# EasyEDA schematic EasyEDA PLsi_v0 schematic source.json

## Sheets
1 CPU & HMI: TITLE: CPU & HMI; REV: 1.0; Date: 2019-08-10; Sheet: 1/3; Drawn By: funnyautomation; Company: funnyautomation
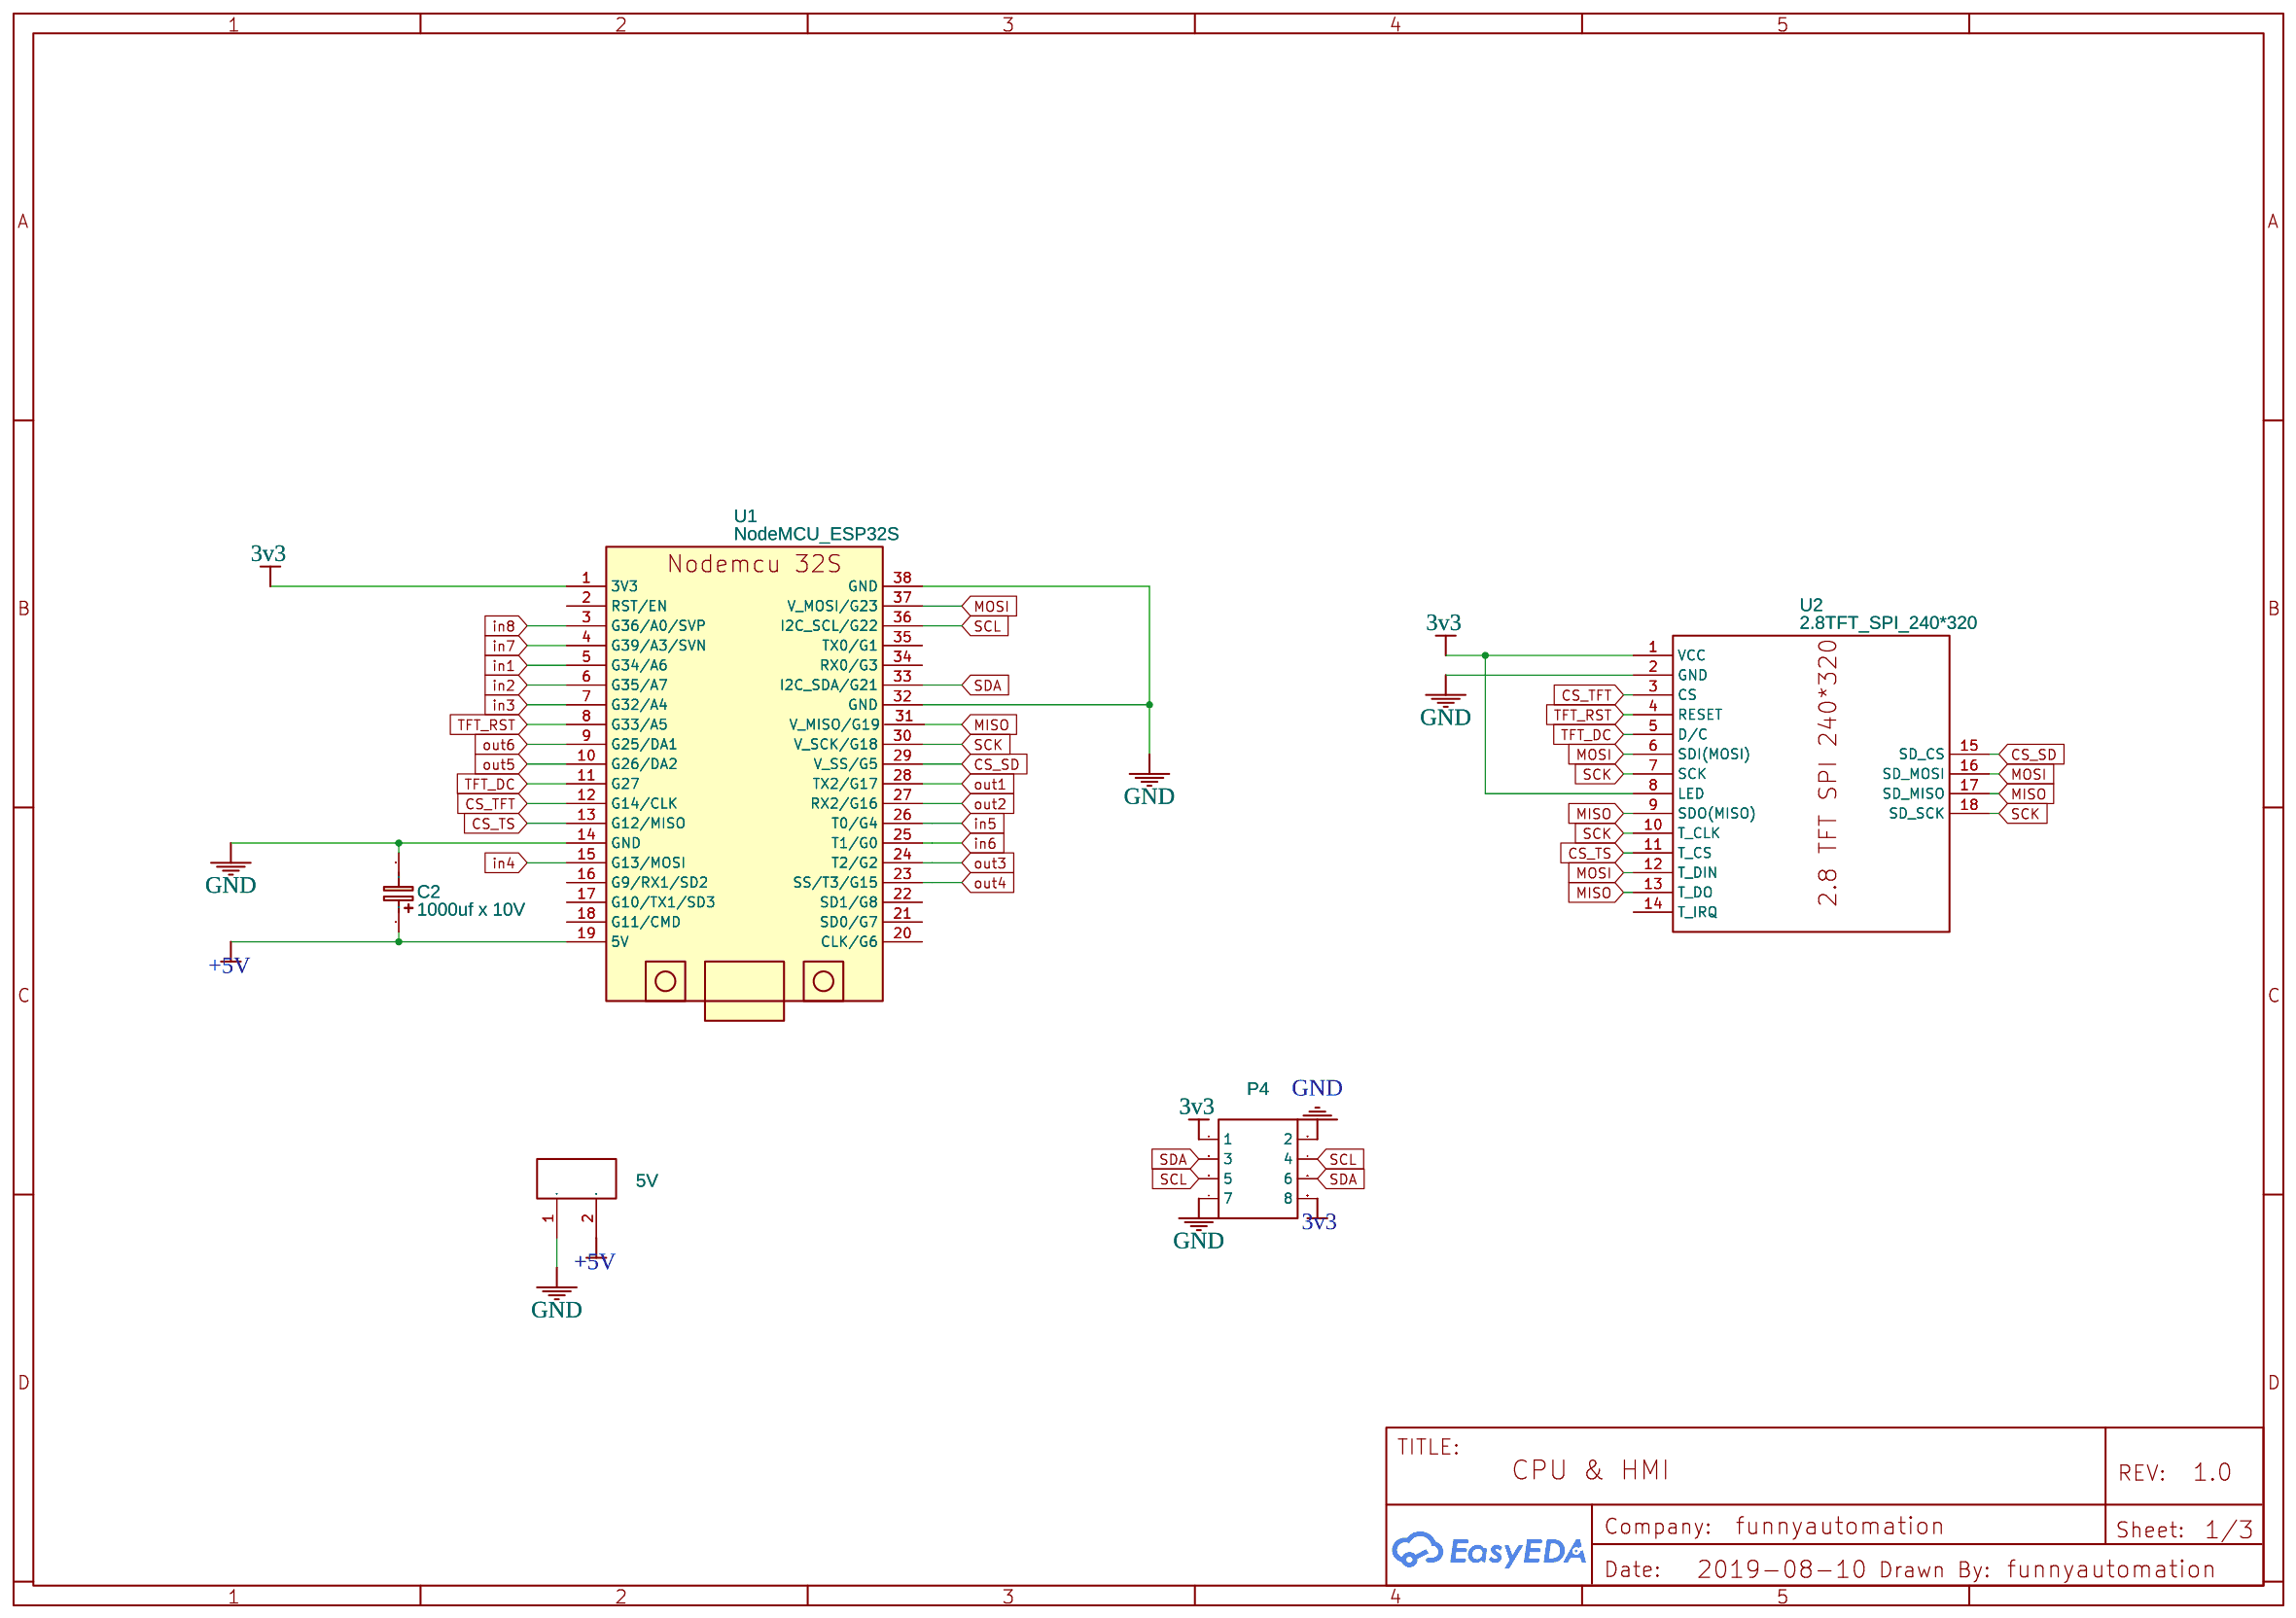
[diagram p0: CPU & HMI]
2 Inputs: TITLE: Inputs; Date: 2019-08-17; Sheet: 2/3
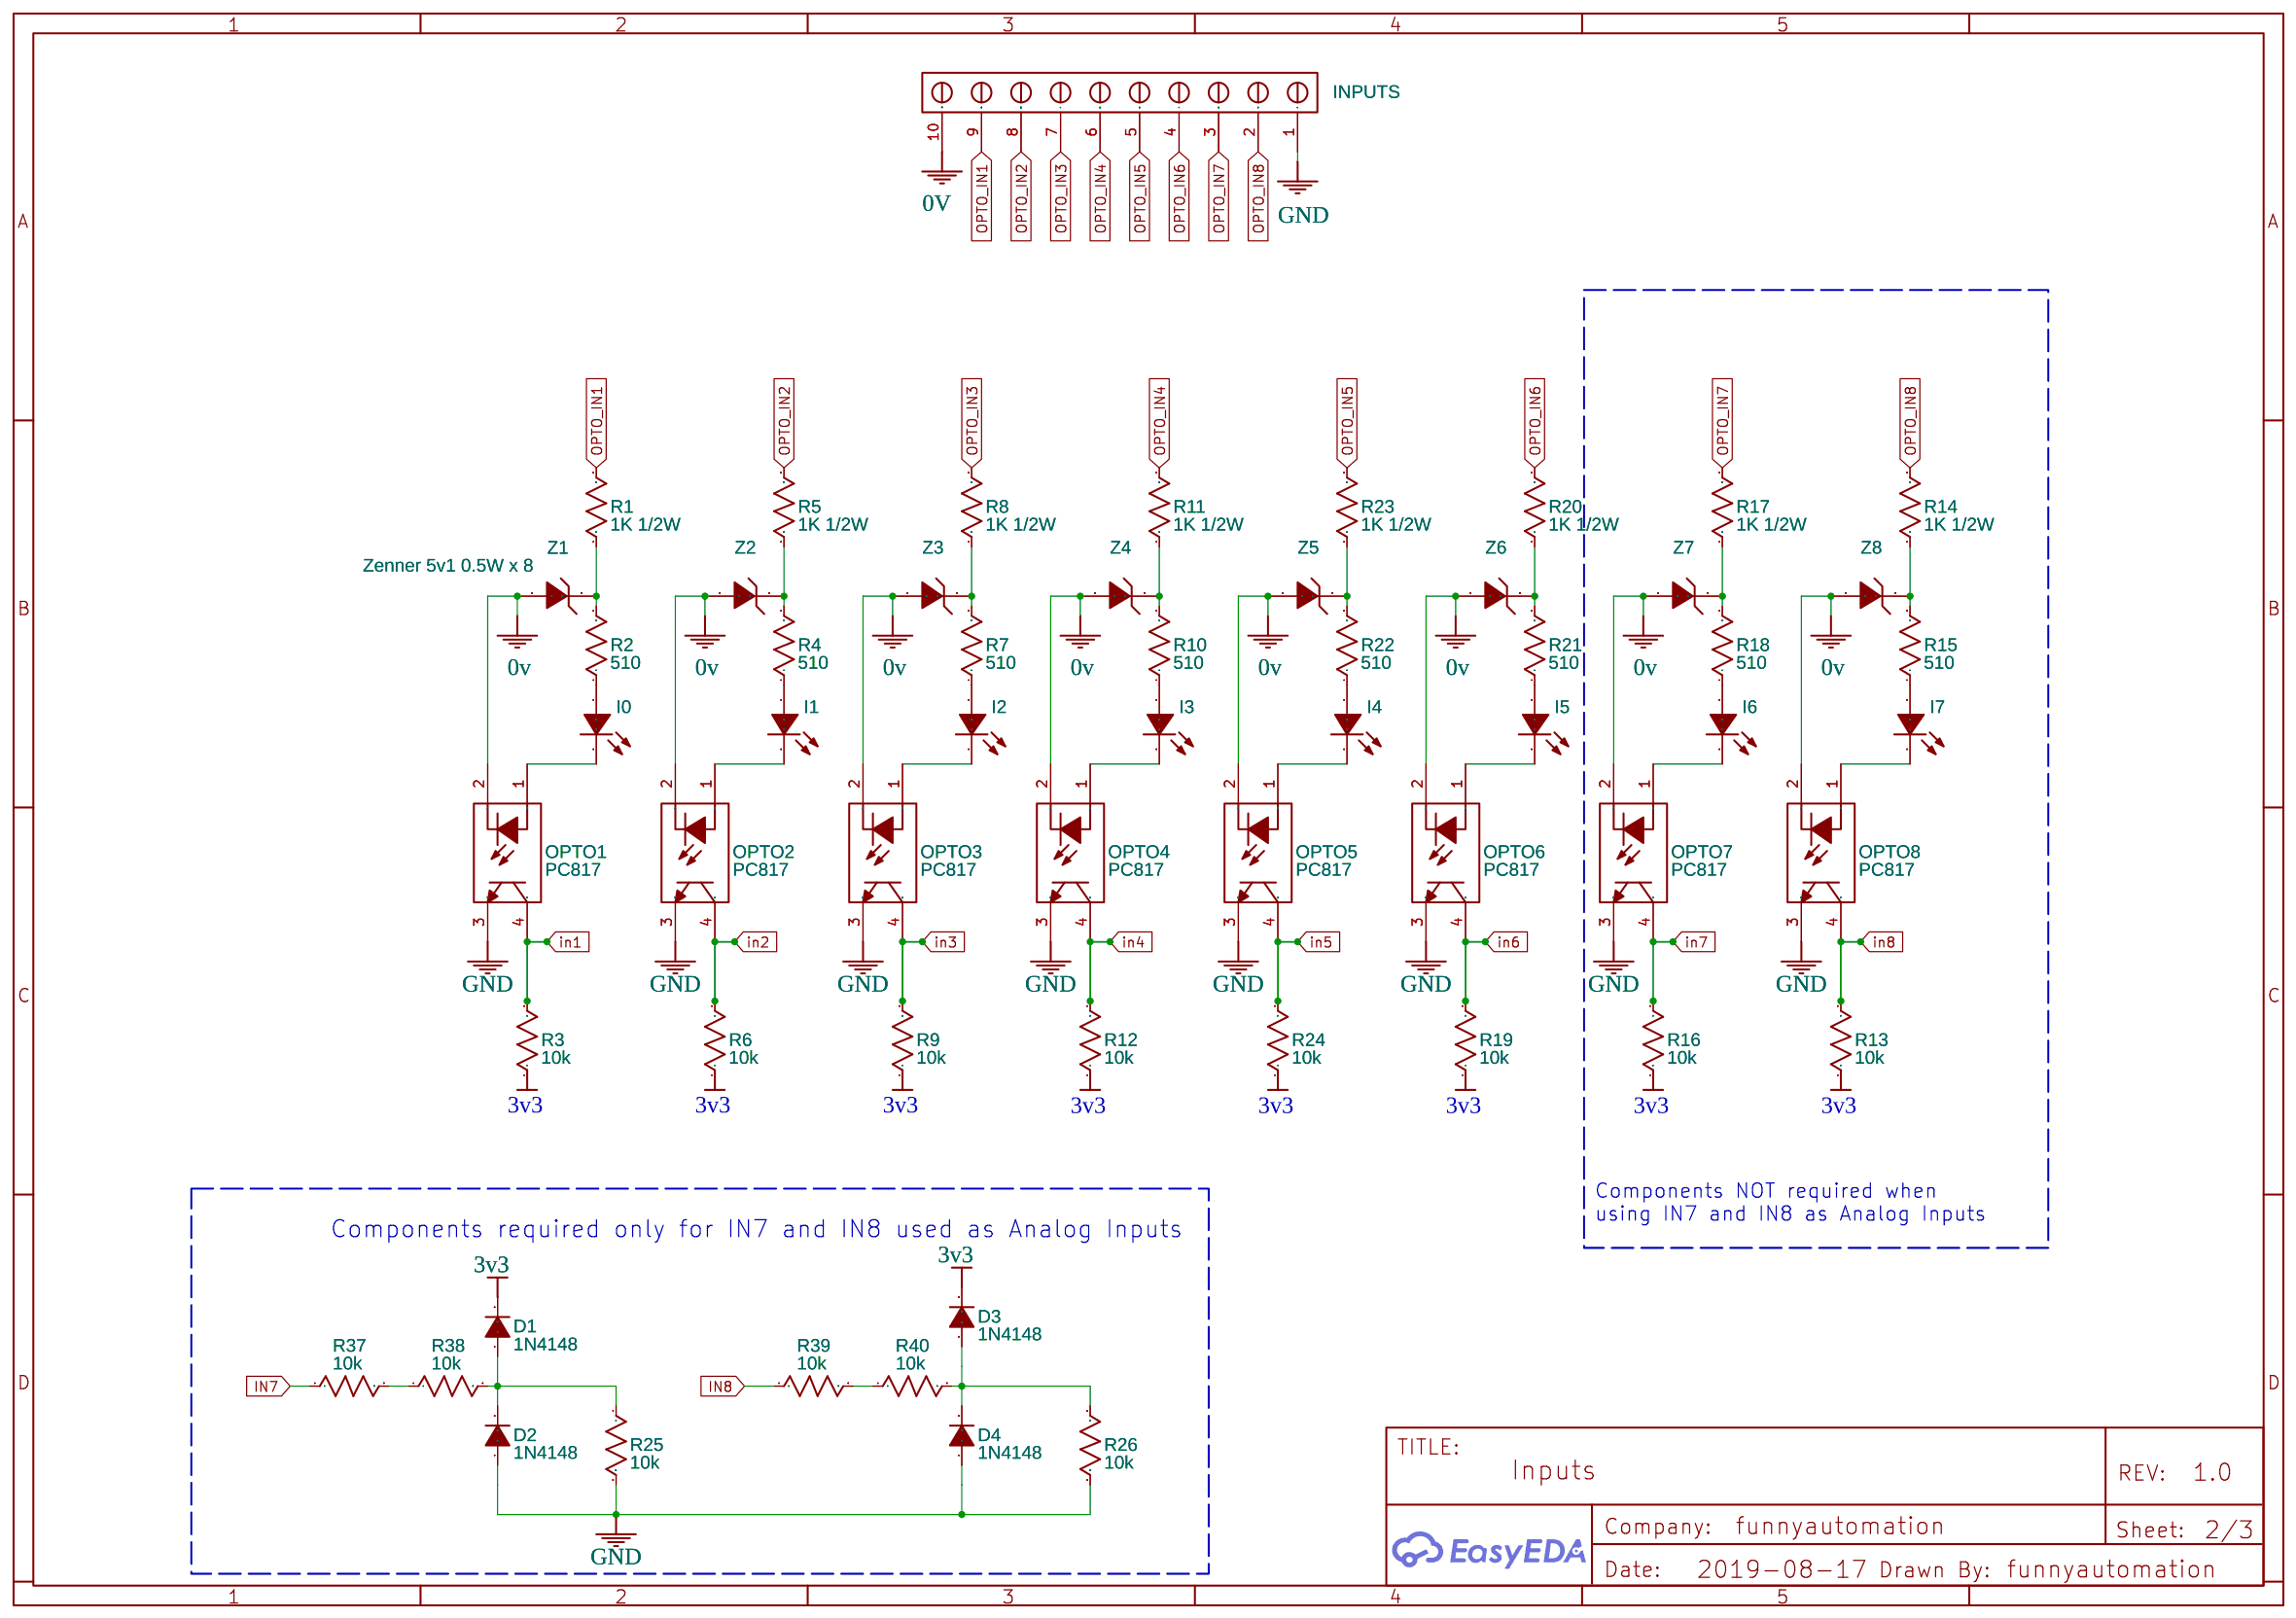
[diagram p1: Inputs]
3 Outputs: TITLE: Sheet_1; Date: 2019-08-17; Sheet: 3/3
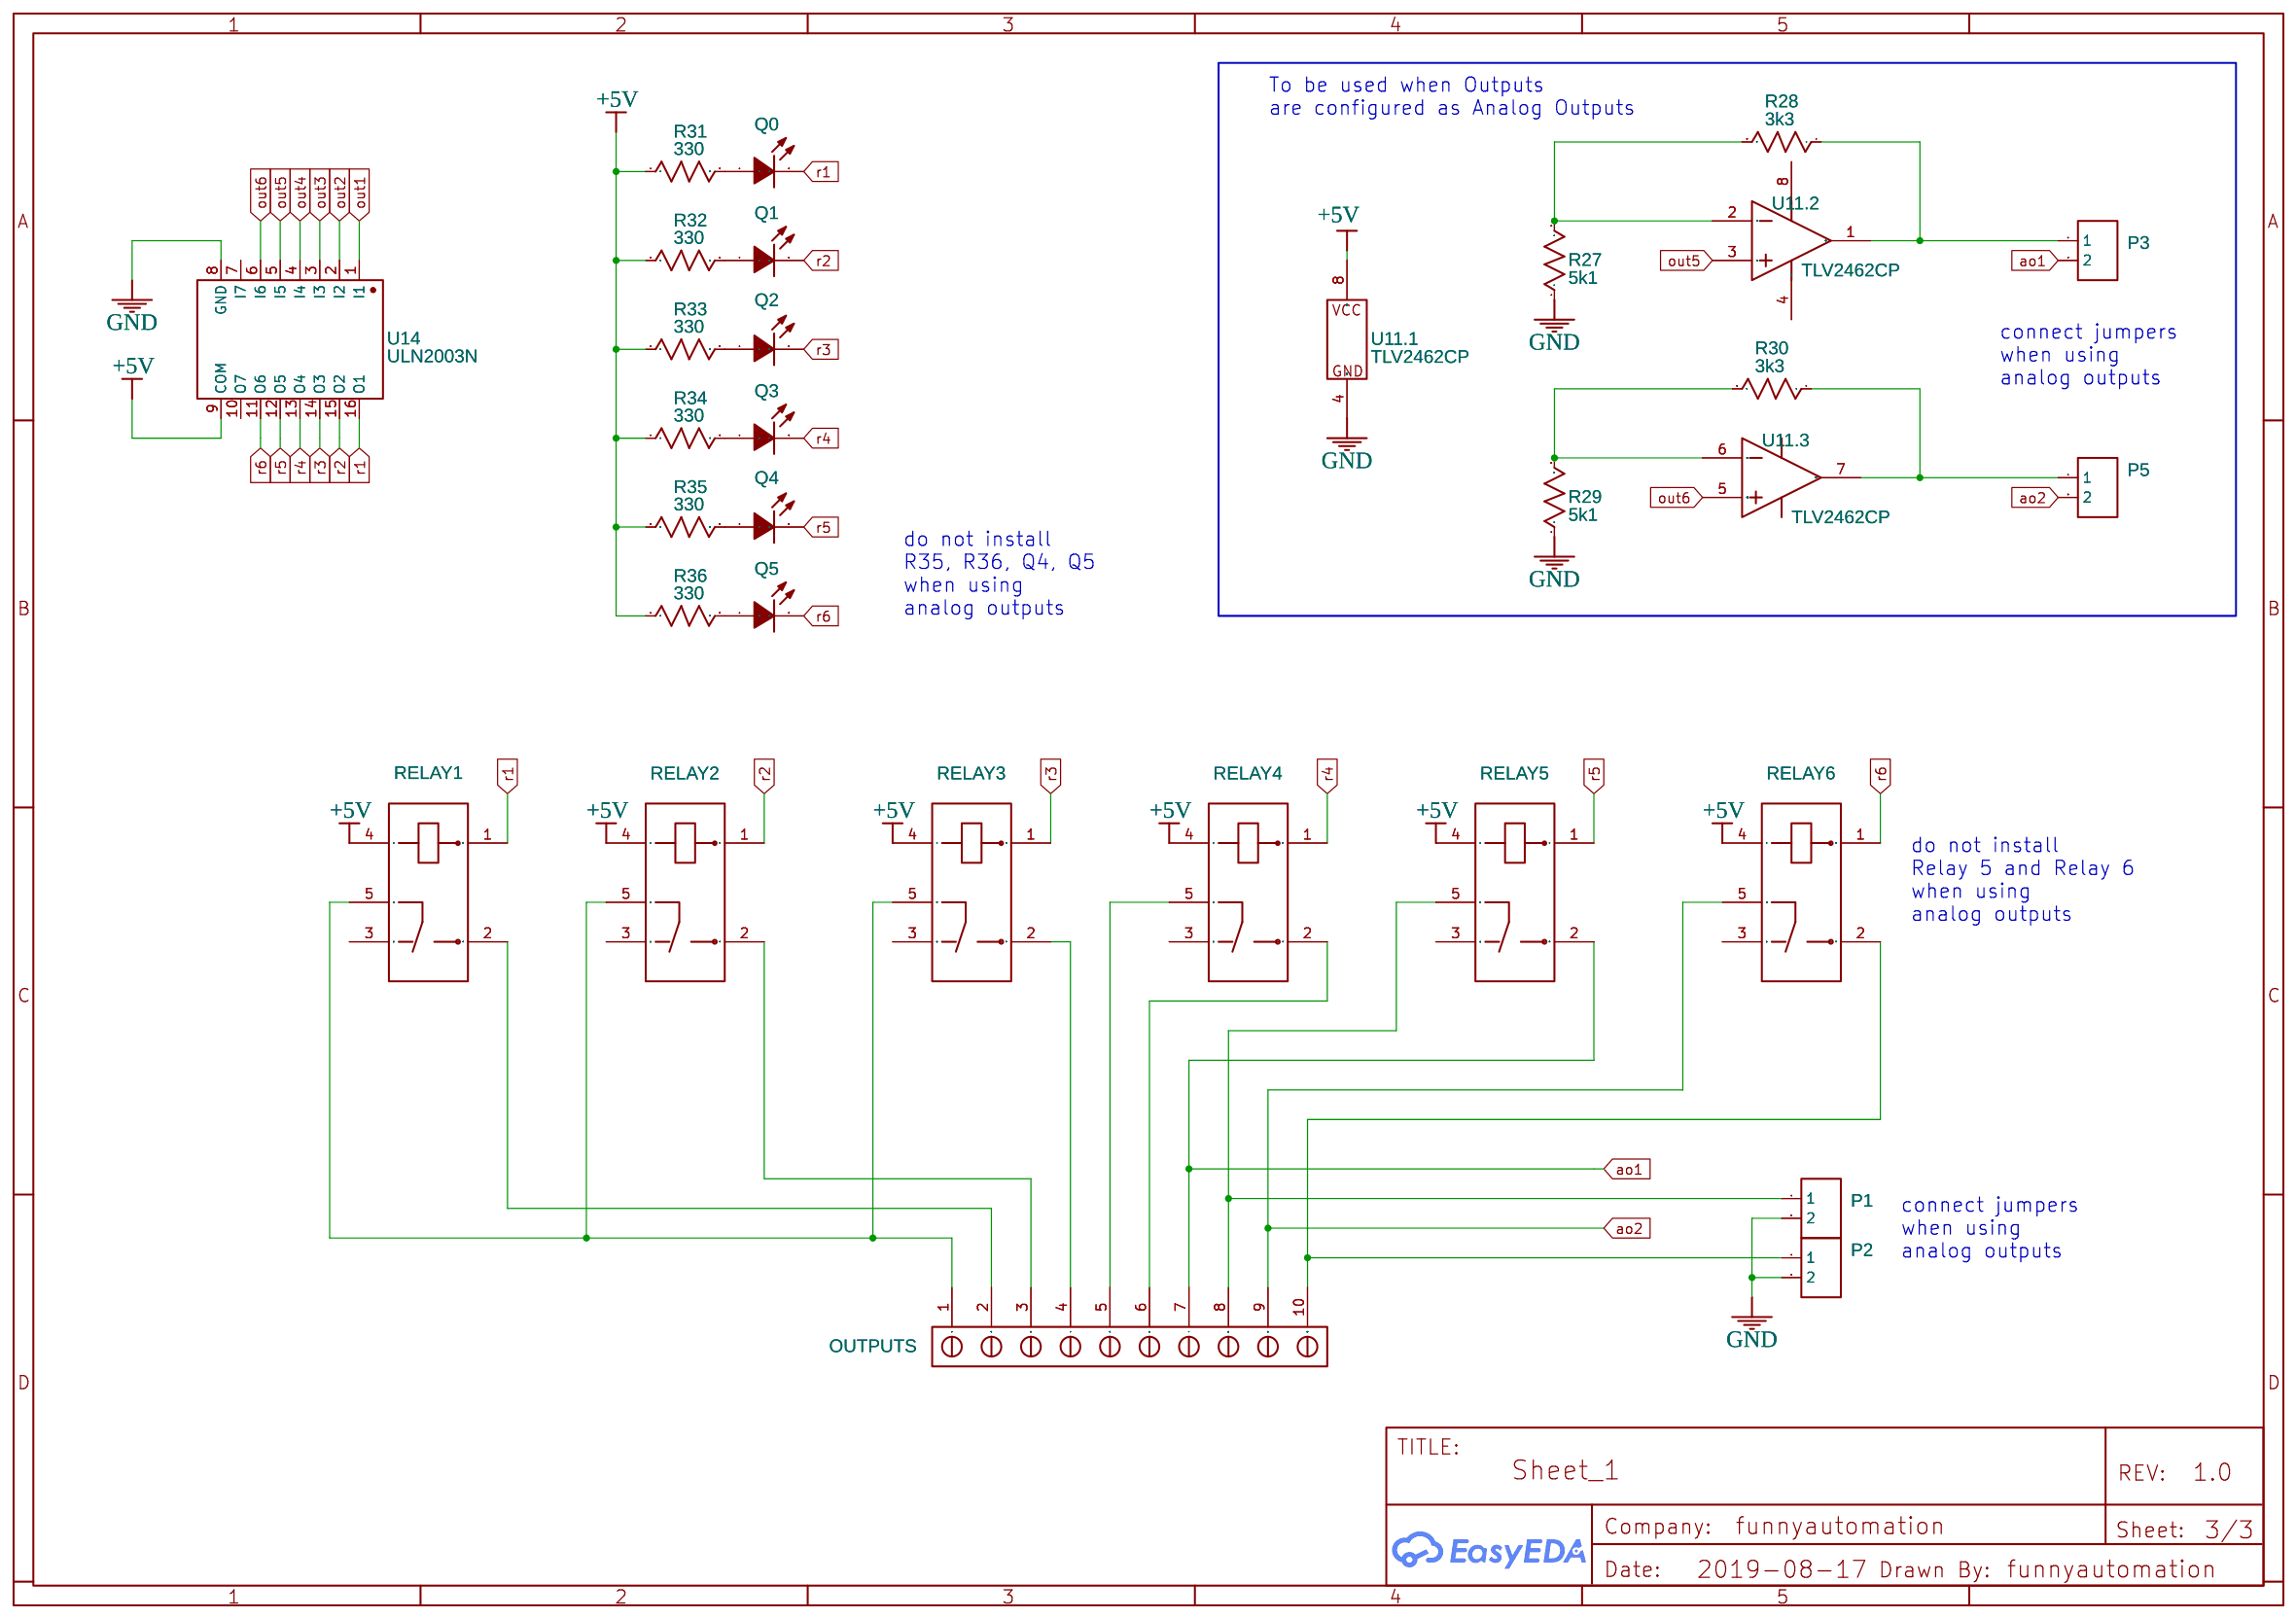
[diagram p2: Outputs]

## Parts
sheet CPU & HMI
5V  Terminal 2 Poles 5.12mm  [BORNERA 2 PINES]
C2  1000uf x 10V  [CAP-D8.0XF3.5]
P4  HDR-IDC-2.54-2X4P (optional i2C expansion)  [HDR-IDC-2.54-2X4P]
U1  NodeMCU_ESP32S  [NODEMCU-ESP32S]
U2  2.8TFT_SPI_240*320  [2.8TFT_SPI_240*320]
sheet Inputs
D1  1N4148  [4148IN]
D2  1N4148  [4148IN]
D3  1N4148  [4148IN]
D4  1N4148  [4148IN]
I0  204-10SURD/S530-A3  [LED-3MM/2.54]
I1  204-10SURD/S530-A3  [LED-3MM/2.54]
I2  204-10SURD/S530-A3  [LED-3MM/2.54]
I3  204-10SURD/S530-A3  [LED-3MM/2.54]
I4  204-10SURD/S530-A3  [LED-3MM/2.54]
I5  204-10SURD/S530-A3  [LED-3MM/2.54]
I6  204-10SURD/S530-A3  [LED-3MM/2.54]
I7  204-10SURD/S530-A3  [LED-3MM/2.54]
INPUTS  TB008A-508-10BE  [TB008A-508-10BE]
OPTO1  PC817  [DIP-4]
OPTO2  PC817  [DIP-4]
OPTO3  PC817  [DIP-4]
OPTO4  PC817  [DIP-4]
OPTO5  PC817  [DIP-4]
OPTO6  PC817  [DIP-4]
OPTO7  PC817  [DIP-4]
OPTO8  PC817  [DIP-4]
R1  1K 1/2W  [AXIAL-0.3]
R2  510  [AXIAL-0.1]
R3  10k  [AXIAL-0.3]
R4  510  [AXIAL-0.1]
R5  1K 1/2W  [AXIAL-0.3]
R6  10k  [AXIAL-0.3]
R7  510  [AXIAL-0.1]
R8  1K 1/2W  [AXIAL-0.3]
R9  10k  [AXIAL-0.3]
R10  510  [AXIAL-0.1]
R11  1K 1/2W  [AXIAL-0.3]
R12  10k  [AXIAL-0.3]
R13  10k  [AXIAL-0.3]
R14  1K 1/2W  [AXIAL-0.3]
R15  510  [AXIAL-0.1]
R16  10k  [AXIAL-0.3]
R17  1K 1/2W  [AXIAL-0.3]
R18  510  [AXIAL-0.1]
R19  10k  [AXIAL-0.3]
R20  1K 1/2W  [AXIAL-0.3]
R21  510  [AXIAL-0.1]
R22  510  [AXIAL-0.1]
R23  1K 1/2W  [AXIAL-0.3]
R24  10k  [AXIAL-0.3]
R25  10k  [AXIAL-0.3]
R26  10k  [AXIAL-0.3]
R37  10k  [AXIAL-0.3]
R38  10k  [AXIAL-0.3]
R39  10k  [AXIAL-0.3]
R40  10k  [AXIAL-0.3]
Z1  Zenner 5v1 0.5W x 8  [DO41_Z_TH]
Z2  Zenner 1w  [DO41_Z_TH]
Z3  Zenner 1w  [DO41_Z_TH]
Z4  Zenner 1w  [DO41_Z_TH]
Z5  Zenner 1w  [DO41_Z_TH]
Z6  Zenner 1w  [DO41_Z_TH]
Z7  Zenner 1w  [DO41_Z_TH]
Z8  Zenner 1w  [DO41_Z_TH]
sheet Outputs
OUTPUTS  TB008A-508-10BE  [TB008A-508-10BE]
P1  Header-Female-2.54_1x2  [HDR-1X2/2.54]
P2  Header-Female-2.54_1x2  [HDR-1X2/2.54]
P3  Header-Female-2.54_1x2  [HDR-1X2/2.54]
P5  Header-Female-2.54_1x2  [HDR-1X2/2.54]
Q0  204-10SURD/S530-A3  [LED-3MM/2.54]
Q1  204-10SURD/S530-A3  [LED-3MM/2.54]
Q2  204-10SURD/S530-A3  [LED-3MM/2.54]
Q3  204-10SURD/S530-A3  [LED-3MM/2.54]
Q4  204-10SURD/S530-A3  [LED-3MM/2.54]
Q5  204-10SURD/S530-A3  [LED-3MM/2.54]
R27  5k1  [AXIAL-0.3]
R28  3k3  [AXIAL-0.3]
R29  5k1  [AXIAL-0.3]
R30  3k3  [AXIAL-0.3]
R31  330  [AXIAL-0.3]
R32  330  [AXIAL-0.3]
R33  330  [AXIAL-0.3]
R34  330  [AXIAL-0.3]
R35  330  [AXIAL-0.3]
R36  330  [AXIAL-0.3]
RELAY1  SRD-05VDC-SL-C  [RELAY-SL-SRD]
RELAY2  SRD-05VDC-SL-C  [RELAY-SL-SRD]
RELAY3  SRD-05VDC-SL-C  [RELAY-SL-SRD]
RELAY4  SRD-05VDC-SL-C  [RELAY-SL-SRD]
RELAY5  SRD-05VDC-SL-C  [RELAY-SL-SRD]
RELAY6  SRD-05VDC-SL-C  [RELAY-SL-SRD]
U11  TLV2462CP  [DIP-8_LS7.62-L9.78-W6.60-PITCH2.54]  (sections 1,2,3)
U14  ULN2003N  [DIP-16_16P-LS7.62-L19.6-W7.7-P2.54-BL]

## Library data of the parts
5V = -: Manufacturer Part: BORNERA CIRCUITO IMPRESO 2PINES; link: http://www.cetronic.es/sqlcommerce/disenos/plantilla1/seccion/Catalogo.jsp?idIdioma=&idTienda=93&cPath=1175; Contributor: capoelectronics
C2 = Cap_Electrolytic(TH)_D8.0XF3.5_EU: Contributor: EasyEDA
P4 = -: Supplier: LCSC; Manufacturer: BOOMELE; Manufacturer Part: IDC Box 2X4 2.54MM; image: //image.lceda.cn/szlcsc/C9135.jpg; Supplier Part: C9135
U1 = -: Manufacturer Part: NodeMCU ESP32S; Contributor: JUAN GUALBERTO ESPIRITU MARCELIANO
U2 = -: Contributor: dmiljkov
D1-D4 = -: Contributor: anoop
I0-I7 Q0-Q5 = -: Supplier: LCSC; Manufacturer: EVERLIGHT; Supplier Part: C99772
INPUTS OUTPUTS = -: Supplier Part: 490-TB008A-508-10BE; Supplier: Mouser; Manufacturer: CUI; link: https://www.mouser.it/datasheet/2/670/tb008a-508-1550650.pdf; Contributor: nexosrl
OPTO1-OPTO8 = -: Supplier: LCSC; Manufacturer: SHARP; Manufacturer Part: PC817X2NSZ9F(B); image: //image.lceda.cn/szlcsc/C60965.jpg; Supplier Part: C60965
R1-R40 = Res_AXIAL-0.3(1/8W)_US
Z1-Z8 = -: image: //image.lceda.cn/szlcsc/C2542.jpg; Contributor: otanezlor
P1-P3 P5 = -: Supplier: LCSC; Manufacturer: BOOMELE; Manufacturer Part: 2.54-1*2PFemale; image: //image.lceda.cn/szlcsc/C49661.jpg; Supplier Part: C49661
RELAY1-RELAY6 = -: Supplier: LCSC; Manufacturer: SONGLE; image: //image.lceda.cn/szlcsc/C35449.jpg; Supplier Part: C35449
U11 = -: Supplier: LCSC; Manufacturer: TI; Supplier Part: C95623; subpart_no: 1
U14 = -: Supplier: LCSC; Supplier Part: C383065; Manufacturer: HGSEMI; Contributor: LCSC

## Nets
0v: OPTO1.2 OPTO2.2 OPTO3.2 OPTO4.2 OPTO5.2 OPTO6.2 OPTO7.2 OPTO8.2 Z1.1(A) Z2.1(A) Z3.1(A) Z4.1(A) Z5.1(A) Z6.1(A) Z7.1(A) Z8.1(A)
0V: INPUTS.10
3v3: D1.2 D3.2 P4.1 P4.8 R3.1 R6.1 R9.1 R12.1 R13.1 R16.1 R19.1 R24.1 U1.1(3V3) U2.1(VCC) U2.8(LED)
+5V: 5V.2 C2.1 R31.1 R32.1 R33.1 R34.1 R35.1 R36.1 RELAY1.4 RELAY2.4 RELAY3.4 RELAY4.4 RELAY5.4 RELAY6.4 U1.19(5V) U11.8(VCC) U14.9(COM)
GND: 5V.1 C2.2 D2.1 D4.1 INPUTS.1 OPTO1.3 OPTO2.3 OPTO3.3 OPTO4.3 OPTO5.3 OPTO6.3 OPTO7.3 OPTO8.3 P1.2 P2.2 P4.2 P4.7 R25.2 R26.2 R27.1 R29.1 U1.14(GND) U1.32(GND) U1.38(GND) U2.2(GND) U11.4(GND) U14.8(GND)
ao1: OUTPUTS.7 P3.2 RELAY5.2
ao2: OUTPUTS.9 P5.2 RELAY6.5
CS_SD: U1.29(V_SS/G5) U2.15(SD_CS)
CS_TFT: U1.12(G14/CLK) U2.3(CS)
CS_TS: U1.13(G12/MISO) U2.11(T_CS)
in1: OPTO1.4 R3.2 U1.5(G34/A6)
in2: OPTO2.4 R6.2 U1.6(G35/A7)
in3: OPTO3.4 R9.2 U1.7(G32/A4)
in4: OPTO4.4 R12.2 U1.15(G13/MOSI)
in5: OPTO5.4 R24.2 U1.26(T0/G4)
in6: OPTO6.4 R19.2 U1.25(T1/G0)
in7: OPTO7.4 R16.2 U1.4(G39/A3/SVN)
IN7: R37.1
in8: OPTO8.4 R13.2 U1.3(G36/A0/SVP)
IN8: R39.1
MISO: U1.31(V_MISO/G19) U2.9(SDO(MISO)) U2.13(T_DO) U2.17(SD_MISO)
MOSI: U1.37(V_MOSI/G23) U2.6(SDI(MOSI)) U2.12(T_DIN) U2.16(SD_MOSI)
OPTO_IN1: INPUTS.9 R1.2
OPTO_IN2: INPUTS.8 R5.2
OPTO_IN3: INPUTS.7 R8.2
OPTO_IN4: INPUTS.6 R11.2
OPTO_IN5: INPUTS.5 R23.2
OPTO_IN6: INPUTS.4 R20.2
OPTO_IN7: INPUTS.3 R17.2
OPTO_IN8: INPUTS.2 R14.2
out1: U1.28(TX2/G17) U14.1(I1)
out2: U1.27(RX2/G16) U14.2(I2)
out3: U1.24(T2/G2) U14.3(I3)
out4: U1.23(SS/T3/G15) U14.4(I4)
out5: U1.10(G26/DA2) U11.3(IN1(+)) U14.5(I5)
out6: U1.9(G25/DA1) U11.5(IN2(+)) U14.6(I6)
r1: Q0.2(K) RELAY1.1 U14.16(O1)
r2: Q1.2(K) RELAY2.1 U14.15(O2)
r3: Q2.2(K) RELAY3.1 U14.14(O3)
r4: Q3.2(K) RELAY4.1 U14.13(O4)
r5: Q4.2(K) RELAY5.1 U14.12(O5)
r6: Q5.2(K) RELAY6.1 U14.11(O6)
SCK: U1.30(V_SCK/G18) U2.7(SCK) U2.10(T_CLK) U2.18(SD_SCK)
SCL: P4.4 P4.5 U1.36(I2C SCL/G22)
SDA: P4.3 P4.6 U1.33(I2C SDA/G21)
TFT_DC: U1.11(G27) U2.5(D/C)
TFT_RST: U1.8(G33/A5) U2.4(RESET)
Net-(D1-1): D1.1 D2.2 R25.1 R38.2
Net-(D3-1): D3.1 D4.2 R26.1 R40.2
Net-(I0-1): I0.1(A) R2.1
Net-(I0-2): I0.2(K) OPTO1.1
Net-(I1-1): I1.1(A) R4.1
Net-(I1-2): I1.2(K) OPTO2.1
Net-(I2-1): I2.1(A) R7.1
Net-(I2-2): I2.2(K) OPTO3.1
Net-(I3-1): I3.1(A) R10.1
Net-(I3-2): I3.2(K) OPTO4.1
Net-(I4-1): I4.1(A) R22.1
Net-(I4-2): I4.2(K) OPTO5.1
Net-(I5-1): I5.1(A) R21.1
Net-(I5-2): I5.2(K) OPTO6.1
Net-(I6-1): I6.1(A) R18.1
Net-(I6-2): I6.2(K) OPTO7.1
Net-(I7-1): I7.1(A) R15.1
Net-(I7-2): I7.2(K) OPTO8.1
Net-(OUTPUTS-1): OUTPUTS.1 RELAY1.5 RELAY2.5 RELAY3.5
Net-(OUTPUTS-2): OUTPUTS.2 RELAY1.2
Net-(OUTPUTS-3): OUTPUTS.3 RELAY2.2
Net-(OUTPUTS-4): OUTPUTS.4 RELAY3.2
Net-(OUTPUTS-5): OUTPUTS.5 RELAY4.5
Net-(OUTPUTS-6): OUTPUTS.6 RELAY4.2
Net-(OUTPUTS-8): OUTPUTS.8 P1.1 RELAY5.5
Net-(OUTPUTS-10): OUTPUTS.10 P2.1 RELAY6.2
Net-(P3-1): P3.1 R28.1 U11.1(OUT1)
Net-(P5-1): P5.1 R30.1 U11.7(OUT2)
Net-(Q0-1): Q0.1(A) R31.2
Net-(Q1-1): Q1.1(A) R32.2
Net-(Q2-1): Q2.1(A) R33.2
Net-(Q3-1): Q3.1(A) R34.2
Net-(Q4-1): Q4.1(A) R35.2
Net-(Q5-1): Q5.1(A) R36.2
Net-(R1-1): R1.1 R2.2 Z1.2(K)
Net-(R4-2): R4.2 R5.1 Z2.2(K)
Net-(R7-2): R7.2 R8.1 Z3.2(K)
Net-(R10-2): R10.2 R11.1 Z4.2(K)
Net-(R14-1): R14.1 R15.2 Z8.2(K)
Net-(R17-1): R17.1 R18.2 Z7.2(K)
Net-(R20-1): R20.1 R21.2 Z6.2(K)
Net-(R22-2): R22.2 R23.1 Z5.2(K)
Net-(R27-2): R27.2 R28.2 U11.2(IN1(-))
Net-(R29-2): R29.2 R30.2 U11.6(IN2(-))
Net-(R37-2): R37.2 R38.1
Net-(R39-2): R39.2 R40.1

Not connected (* = marked no-connect by the designer): RELAY1 3; RELAY2 3; RELAY3 3; RELAY4 3; RELAY5 3; RELAY6 3; U1 2(RST/EN) 16(G9/RX1/SD2) 17(G10/TX1/SD3) 18(G11/CMD) 20(CLK/G6) 21(SD0/G7) 22(SD1/G8) 34(RX0/G3) 35(TX0/G1); U2 14(T_IRQ); U14 7(I7) 10(O7)

## Notes on the sheets
sheet 2
- Components NOT required when
  using IN7 and IN8 as Analog Inputs
- Components required only for IN7 and IN8 used as Analog Inputs
sheet 3
- To be used when Outputs
  are configured as Analog Outputs
- connect jumpers
  when using
  analog outputs
- do not install
  R35, R36, Q4, Q5
  when using
  analog outputs
- do not install
  Relay 5 and Relay 6
  when using
  analog outputs
- connect jumpers
  when using
  analog outputs
